# EAGLE design kit_calibration_VNA (EAGLE 9.2.0)
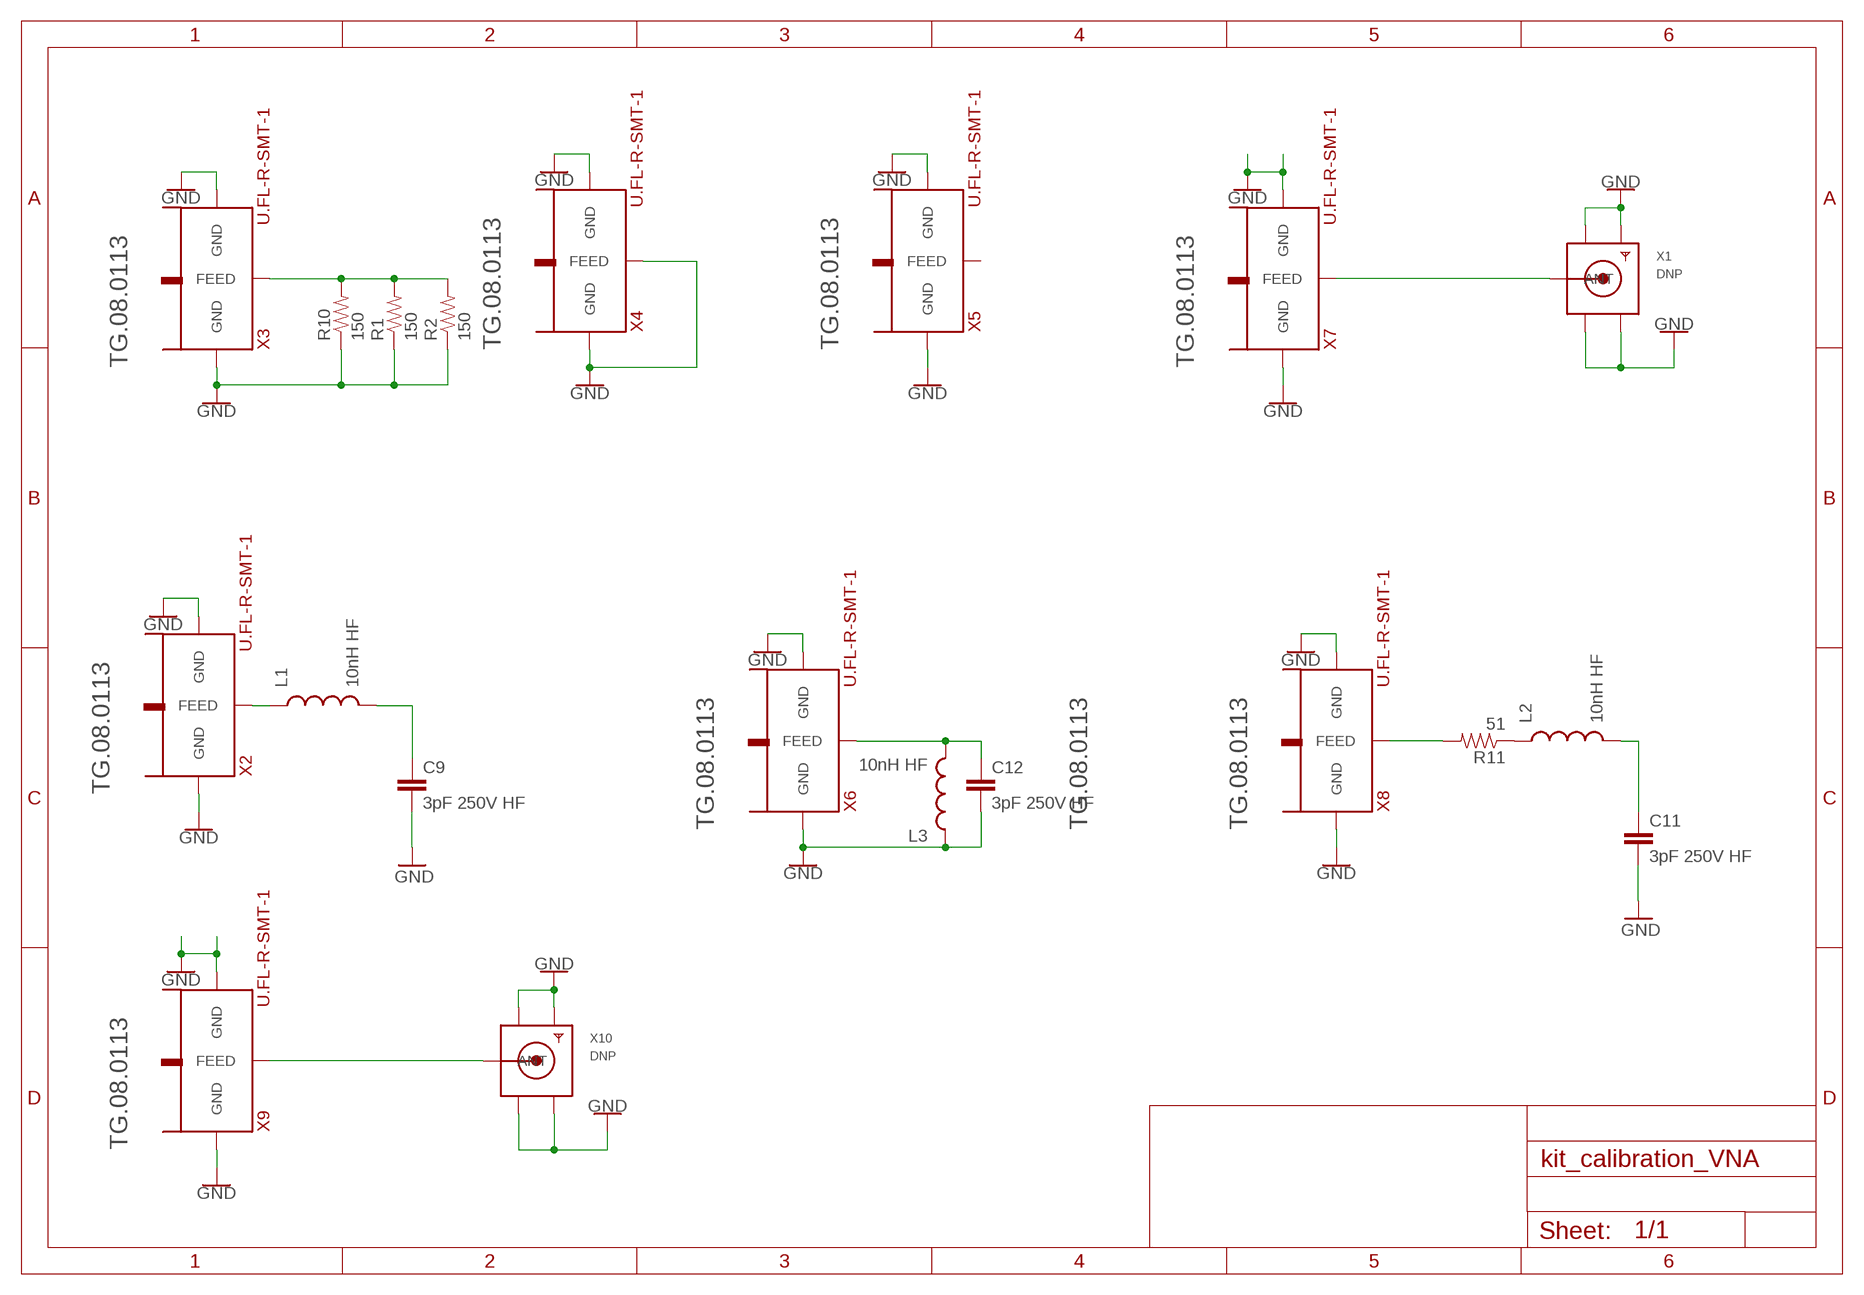
[diagram p0: schematic, sheet 1]

## Parts
C9  3pF 250V HF  CAP0603-CAP  [0603-CAP]
C11  3pF 250V HF  CAP0603-CAP  [0603-CAP]
C12  3pF 250V HF  CAP0603-CAP  [0603-CAP]
L1  10nH HF  INDUCTOR0603  [0603]
L2  10nH HF  INDUCTOR0603  [0603]
L3  10nH HF  INDUCTOR0603  [0603]
R1  150  RESISTOR0603-RES  [0603-RES]
R2  150  RESISTOR0603-RES  [0603-RES]
R10  150  RESISTOR0603-RES  [0603-RES]
R11  51  RESISTOR0603-RES  [0603-RES]
X1  DNP  SMACONNECTOR_EDGE  [SMA_EDGELAUNCH]
X2  U.FL-R-SMT-1  [U.FL-R-SMT-1]
X3  U.FL-R-SMT-1  [U.FL-R-SMT-1]
X4  U.FL-R-SMT-1  [U.FL-R-SMT-1]
X5  U.FL-R-SMT-1  [U.FL-R-SMT-1]
X6  U.FL-R-SMT-1  [U.FL-R-SMT-1]
X7  U.FL-R-SMT-1  [U.FL-R-SMT-1]
X8  U.FL-R-SMT-1  [U.FL-R-SMT-1]
X9  U.FL-R-SMT-1  [U.FL-R-SMT-1]
X10  DNP  SMACONNECTOR_EDGE  [SMA_EDGELAUNCH]

## Nets
GND: C9.2 C11.2 C12.2 L3.1 R1.1 R2.1 R10.1 X1.GND@1(GND4) X1.GND@2(GND3) X1.GND@3(GND2) X1.GND@4(GND1) X2.P$1(GND) X2.P$2(GND) X3.P$1(GND) X3.P$2(GND) X4.P$1(GND) X4.P$2(GND) X4.P$3(FEED) X5.P$1(GND) X5.P$2(GND) X6.P$1(GND) X6.P$2(GND) X7.P$1(GND) X7.P$2(GND) X8.P$1(GND) X8.P$2(GND) X9.P$1(GND) X9.P$2(GND) X10.GND@1(GND4) X10.GND@2(GND3) X10.GND@3(GND2) X10.GND@4(GND1)
N$1: X9.P$3(FEED) X10.P(ANT)
N$4: C9.1 L1.2
N$5: L2.1 R11.1
N$7: R1.2 R2.2 R10.2 X3.P$3(FEED)
N$9: L1.1 X2.P$3(FEED)
N$13: R11.2 X8.P$3(FEED)
N$14: C11.1 L2.2
N$16: C12.1 L3.2 X6.P$3(FEED)
N$17: X1.P(ANT) X7.P$3(FEED)
Unconnected: X5.P$3(FEED)

## Notes on the sheet
- TG.08.0113 | TG.08.0113
- TG.08.0113 | TG.08.0113
- TG.08.0113
- TG.08.0113 | TG.08.0113 | TG.08.0113
- TG.08.0113

## Library data of the parts
C9 C11 C12 = UNodino:CAP: Capacitor Standard 0603 ceramic capacitor, and 0.1" leaded capacitor.
L1-L3 = UNodino:INDUCTOR: Inductors SDR0805 Series - SMD Power Inductors 7.30mm x 7.30mm x 5.30mm
R1 R2 R10 R11 = UNodino:RESISTOR: Resistor Basic schematic elements and footprints for 0603, 1206, and PTH resistors.
X1 X10 = Adafruit RFM+LoRa Breakout:SMACONNECTOR: SMA Connector 90° DIP SMA Connector, 50 Ohm (4UConnector: 07259); DIGIKEY: CON-SMA-EDGE-S-ND
X2-X9 = gateway_finalV2:U.FL-R-SMT-1: Connecteur coaxial / RF, Coaxial U.FL, Jack droit, Montage en surface vertical, 50 ohm, Laiton; STOCK: U.FL-R-SMT-1(10) - Connecteur coaxial / RF, Coaxial U.FL

## Net classes
0 default: width 0.152 mm

## Board
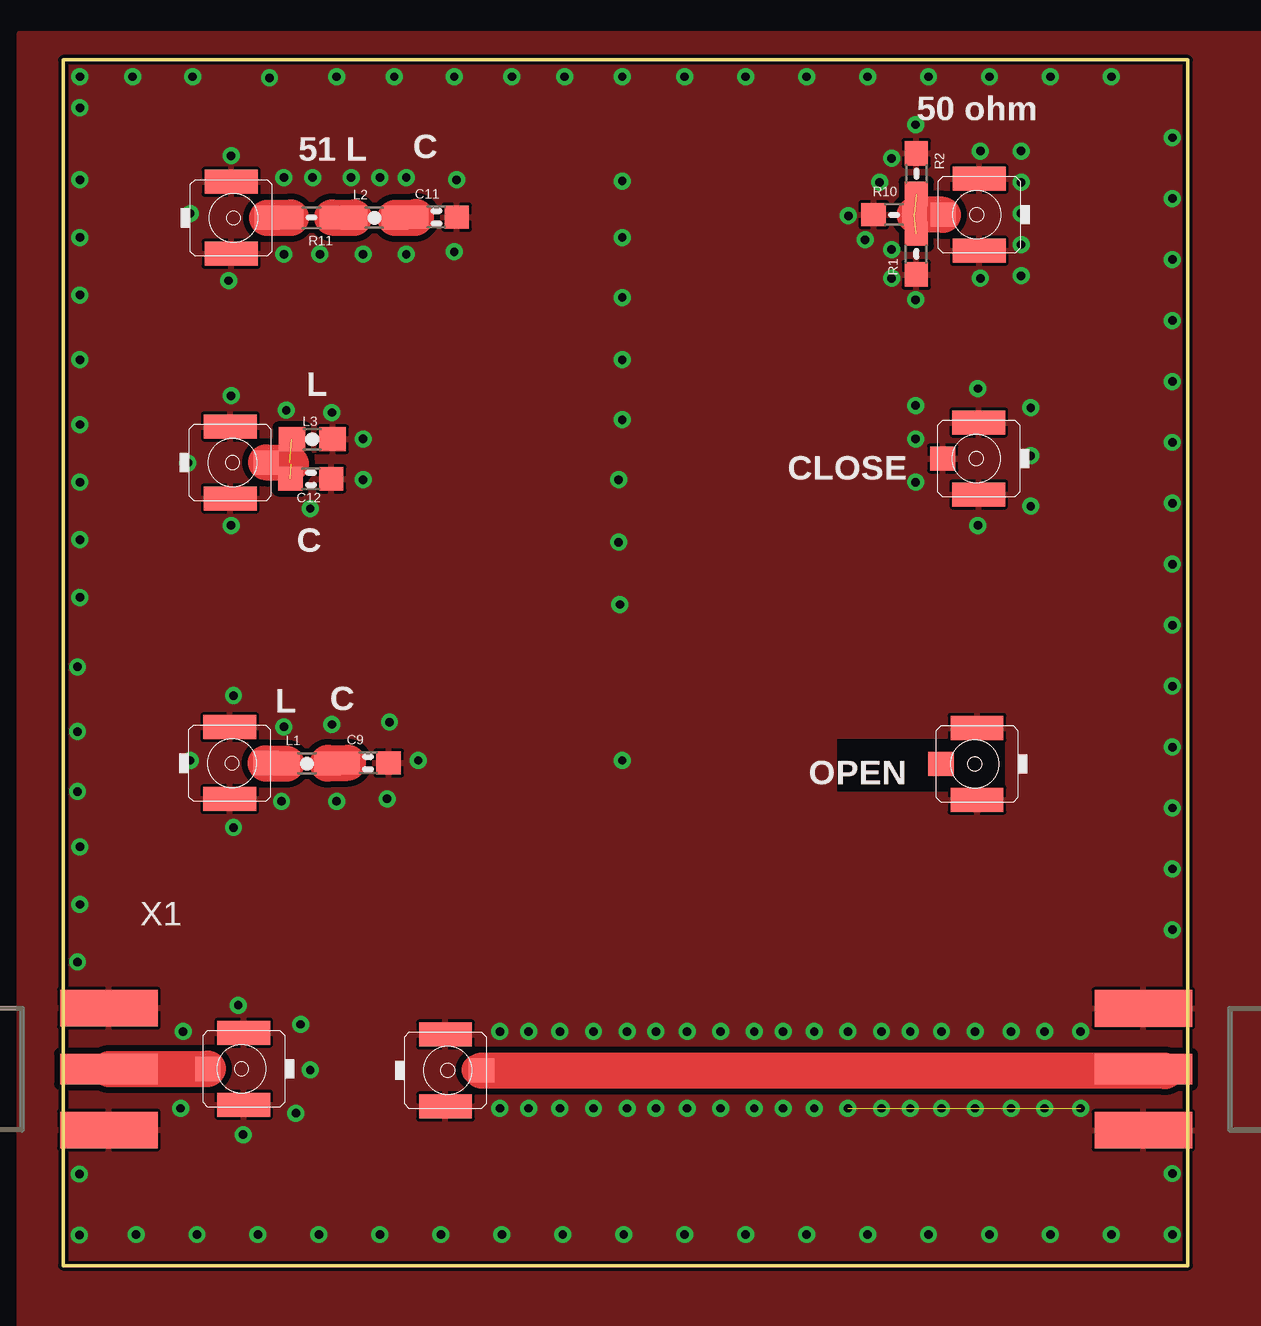
[diagram p1: board, top side]
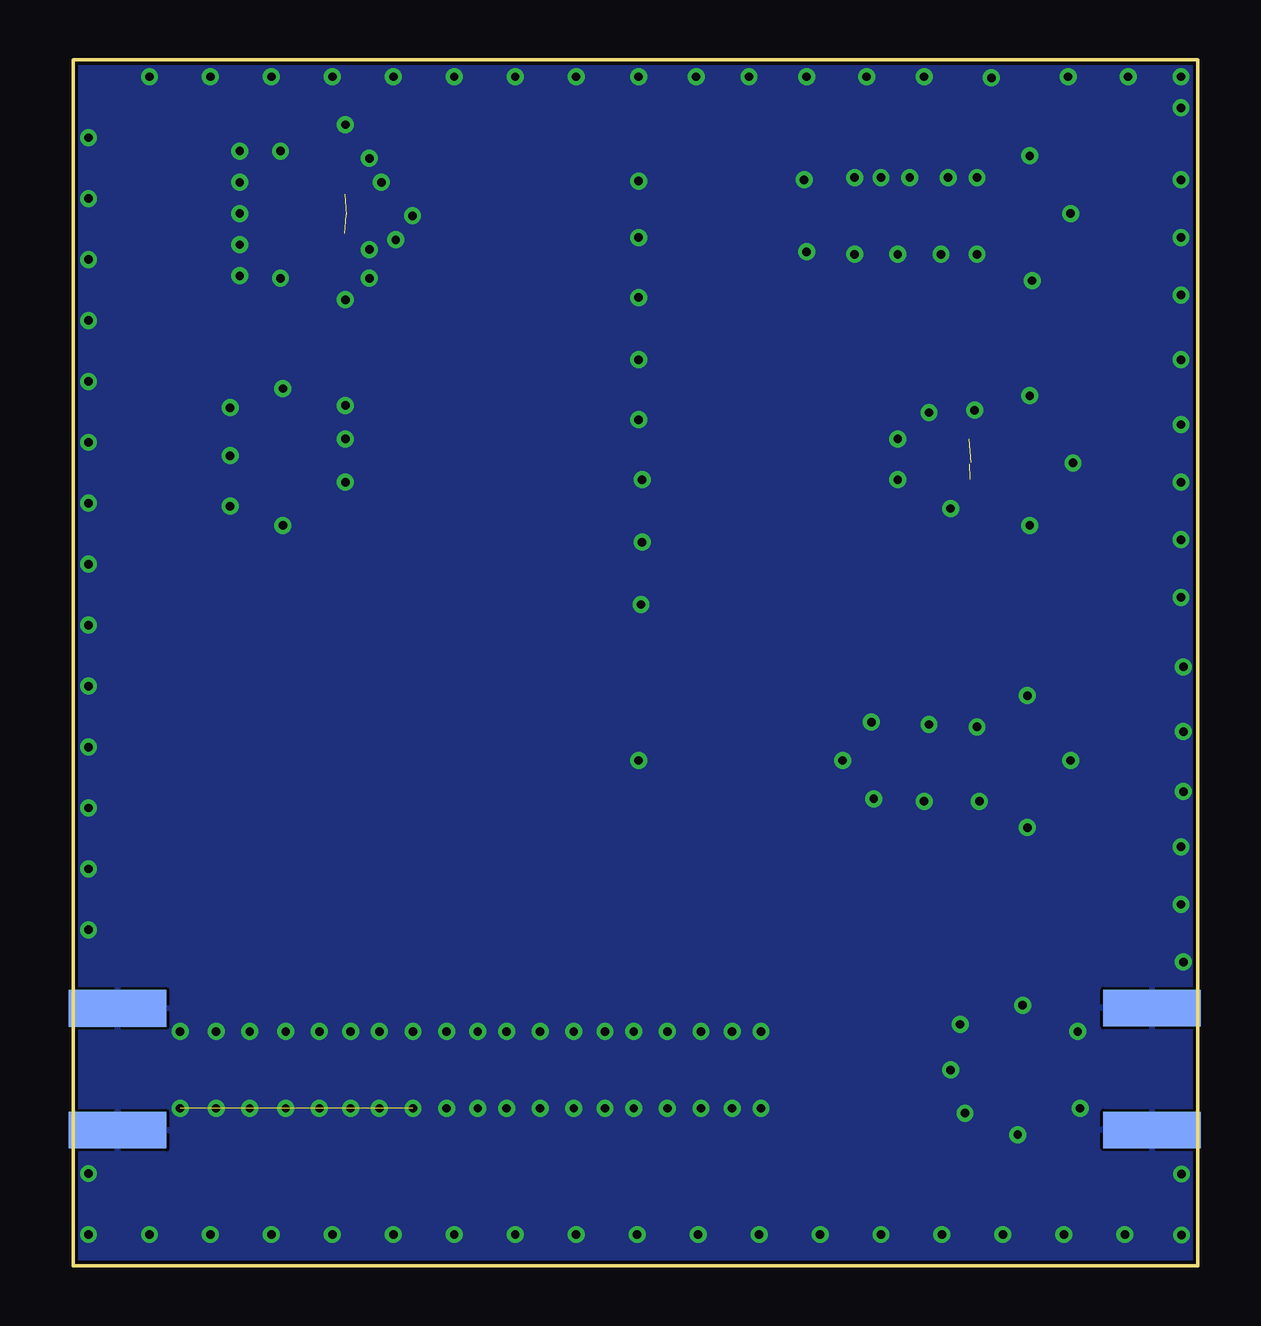
[diagram p2: board, bottom side, seen from below]

Size 46.86 x 50.26 mm. Coordinates in mm from the lower left corner, seen from the top.
Outline: 46.86,50.26 0,50.26 0,0 46.86,0 46.86,50.26
Copper layers (1*16): Top 0.0356mm / dielectric 1.5011mm / Bottom 0.0356mm
Design rules "my_2_layer *": minimum track width 6mil, minimum drill 13mil, track to track 0.25mm, track to pad 5mil, pad to pad 5mil, via to via 6mil, smd to smd 5mil, copper to edge 5mil, drill to drill 5mil, minimum pad ring 7mil, minimum via ring 7mil, stop-mask expansion 2.5mil, vias tented up to drill 20mil, thermal gap 5mil
tRestrict: area 32.3,19.8 to 39.2,21.9

### Footprints (pad centres in the part's own frame; a part is rotated, then mirrored left to right if it is on the bottom)
0603-CAP = smd 1.016 x 0.965: 1 -0.85,0; 2 0.85,0
0603 = smd 1.1 x 1: 1 -0.85,0; 2 0.85,0
0603-RES = smd 1.016 x 0.965: 1 -0.85,0; 2 0.85,0
SMA_EDGELAUNCH = smd 4.064 x 1.524: GND@1 2.032,-2.54; GND@2 2.032,2.54 | smd 4.064 x 1.524 bottom: GND@3 2.032,2.54; GND@4 2.032,-2.54 | smd 4.064 x 1.27: P 2.032,0
U.FL-R-SMT-1 = smd 1 x 2.2: P$1 -1.5,-0.1; P$2 1.5,-0.1 | smd 1 x 1.05: P$3 0,1.4

### Placement (x,y rotation side)
C9  12.71,20.96 0 top
C11  15.55,43.71 0 top
C12  10.32,32.8 0 top
L1  10.16,20.93 0 top
L2  12.97,43.68 0 top
L3  10.38,34.45 180 top
R1  35.55,42.17 90 top
R2  35.55,45.52 270 top
R10  34.62,43.81 0 top
R11  10.35,43.69 180 top
X1  -0.13,8.2 0 top
X2  7.04,20.95 270 top
X3  38.07,43.81 90 top
X4  38.05,33.65 90 top
X5  37.98,20.92 90 top
X6  7.06,33.48 270 top
X7  7.43,8.21 90 top
X8  7.1,43.68 270 top
X9  16.03,8.14 270 top
X10  47.04,8.19 180 top

### Tracks (layer width: path | path; a pad name or v marks a point on that pad's centre or on a via)
GND  (via drill 0.35)  (7 unrouted)
  other vias: 0.7,45.26 0.7,42.86 0.7,40.46 0.7,37.76 0.7,35.06 0.7,32.66 0.7,30.26 0.7,27.86 0.6,24.96 0.6,22.26 0.7,48.26 0.7,49.56 2.9,49.56 5.4,49.56 11.4,49.56 13.8,49.56 16.3,49.56 18.7,49.56 20.9,49.56 23.3,49.56 23.3,45.21 23.3,42.86 23.3,40.36 23.3,37.76 23.3,35.26 23.15,32.76 23.15,30.16 23.2,27.56 11.2,35.56 23.3,21.06 8.6,49.51 35.52,40.26 34.52,41.16 34.52,42.36 33.42,42.76 32.72,43.76 34.02,45.16 34.52,46.16 35.52,47.56 38.22,46.46 39.92,46.46 39.92,45.16 39.92,43.86 39.92,42.56 39.92,41.26 38.22,41.16 35.52,35.86 35.52,34.46 35.52,32.66 38.12,30.86 38.12,36.56 40.32,35.76 40.32,33.76 40.32,31.66 12.5,34.46 12.5,32.76 10.3,31.56 9.3,35.66 7,30.86 5.2,33.46 7,36.26 9.2,42.16 10.7,42.16 12.5,42.16 14.3,42.16 16.3,42.26 16.4,45.26 14.3,45.36 13.2,45.36 12,45.36 10.4,45.36 9.2,45.36 7,46.26 5.3,43.86 6.9,41.06 7.1,23.76 9.2,22.46 11.2,22.56 13.6,22.66 14.8,21.06 13.5,19.46 11.4,19.36 9.1,19.36 7.1,18.26 5.3,21.06 5,9.76 4.9,6.56 7.3,10.86 9.9,10.06 10.3,8.16 9.7,6.36 7.5,5.46 18.2,9.76 19.4,9.76 20.7,9.76 22.1,9.76 23.5,9.76 24.7,9.76 26,9.76 27.4,9.76 28.8,9.76 30,9.76 31.3,9.76 32.7,9.76 34.1,9.76 35.3,9.76 36.6,9.76 38,9.76 39.5,9.76 40.9,9.76 42.4,9.76 18.2,6.56 19.4,6.56 20.7,6.56 22.1,6.56 23.5,6.56 24.7,6.56 26,6.56 27.4,6.56 28.8,6.56 30,6.56 31.3,6.56 32.7,6.56 34.1,6.56 35.3,6.56 36.6,6.56 38,6.56 39.5,6.56 40.9,6.56 42.4,6.56 0.6,19.76 0.7,17.46 0.7,15.06 0.6,12.66 25.9,49.56 28.44,49.56 30.98,49.56 33.52,49.56 36.06,49.56 38.6,49.56 41.14,49.56 43.68,49.56 46.22,47.02 46.22,44.48 46.22,41.94 46.22,39.4 46.22,36.86 46.22,34.32 46.22,31.78 46.22,29.24 46.22,26.7 46.22,24.16 46.22,21.62 46.22,19.08 46.22,16.54 46.22,14 46.22,3.84 46.22,1.3 41.14,1.3 43.68,1.3 38.6,1.3 36.06,1.3 30.98,1.3 33.52,1.3 28.44,1.3 25.9,1.3 23.36,1.3 20.82,1.3 18.28,1.3 15.74,1.3 13.2,1.3 10.66,1.3 8.12,1.3 5.58,1.3 3.04,1.3 0.68,1.28 0.68,3.82
  pour Bottom: 49.7,-3.5 49.7,51.36 -0.2,51.36 -0.2,-3.5
  pour Top: -1.8,51.36 50.2,51.36 50.2,-3.54 -1.8,-3.54
N$1
  Top 1.27: X10.P 44.98,8.16 17.41,8.16 | 17.23,8.16 17.41,8.16 | 17.41,8.16 X9.P$3
  Top 1.5: X9.P$3 45.89,8.14 45.91,8.12 45.9,8.12
N$4
  Top 1.5: L1.2 11.04,20.96 C9.1
N$5
  Top 1.5: R11.1 L2.1
N$7  (2 unrouted)
  Top 1.5: X3.P$3 R10.2
N$9
  Top 1.5: X2.P$3 8.46,20.93 L1.1
N$13
  Top 1.5: X8.P$3 R11.2
N$14
  Top 1.5: L2.2 14.67,43.68 C11.1
N$16  (2 unrouted)
  Top 1.5: X6.P$3 9.44,33.48 9.5,33.42
N$17
  Top 1.5: X1.P X7.P$3

### Text on the board
tPlace: 50 ohm | 51 L | C | L | CLOSE | C | L | C | OPEN